# EAGLE design Adafruit BNO055 STEMMA QT (EAGLE 9.6.1)
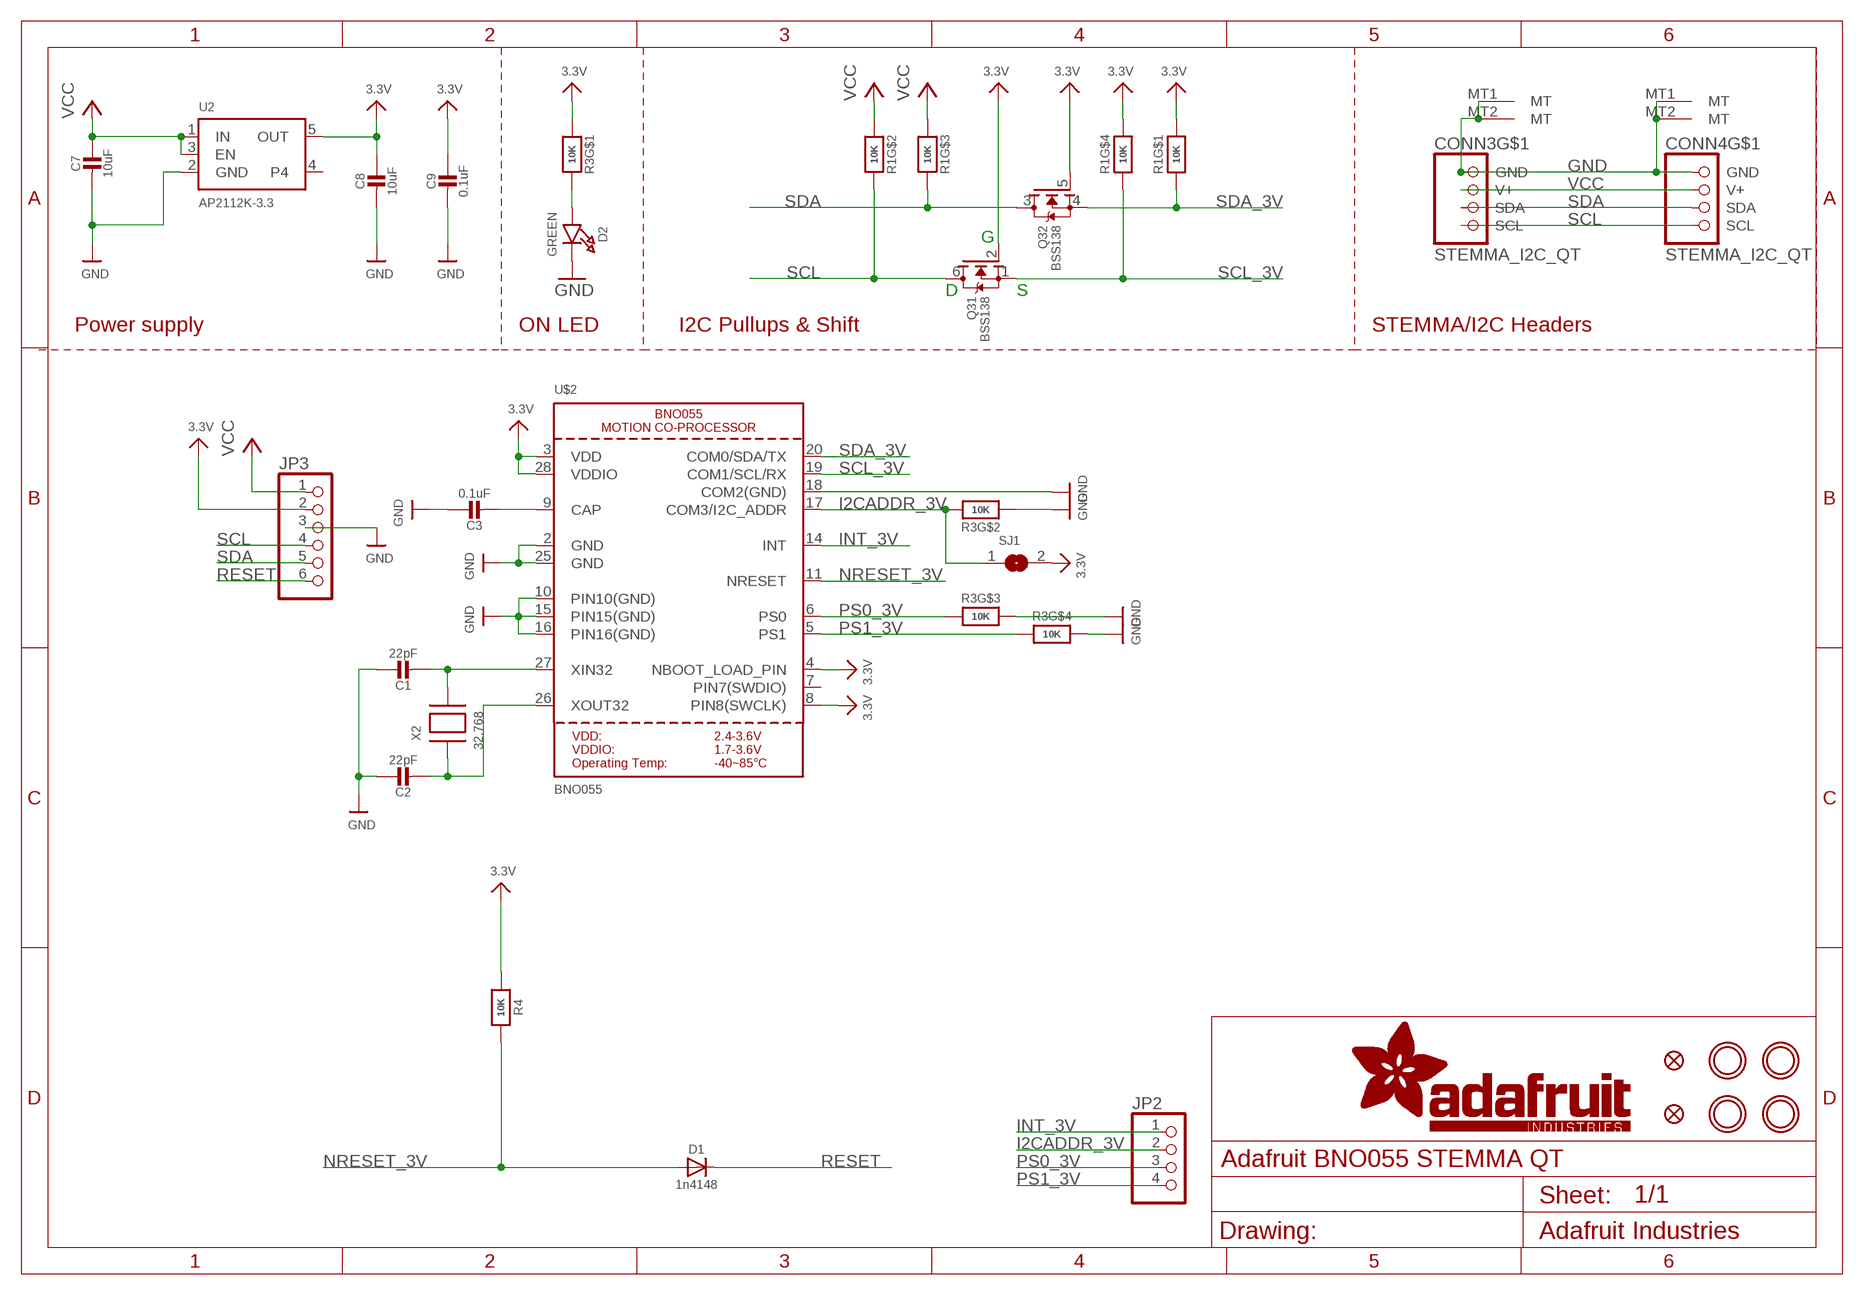
[diagram p0: schematic, sheet 1]

## Parts
C1  22pF  CAP_CERAMIC0603_NO  [0603-NO]
C2  22pF  CAP_CERAMIC0603_NO  [0603-NO]
C3  0.1uF  CAP_CERAMIC0603_NO  [0603-NO]
C7  10uF  CAP_CERAMIC0805-NOOUTLINE  [0805-NO]
C8  10uF  CAP_CERAMIC0805-NOOUTLINE  [0805-NO]
C9  0.1uF  CAP_CERAMIC0603_NO  [0603-NO]
CONN3  STEMMA_I2C_QT  [JST_SH4]
CONN4  STEMMA_I2C_QT  [JST_SH4]
D1  1n4148  DIODESOD-323  [SOD-323]
D2  GREEN  LED0603_NOOUTLINE  [CHIPLED_0603_NOOUTLINE]
FID3  FIDUCIAL_1MM  [FIDUCIAL_1MM]
FID4  FIDUCIAL_1MM  [FIDUCIAL_1MM]
JP2  HEADER-1X476MIL  [1X04_ROUND_76]
JP3  HEADER-1X670MIL  [1X06_ROUND_70]
Q3  BSS138  MOSFET-N_DUAL  [SOT363]
R1  10K  RESISTOR_4PACK  [RESPACK_4X0603]
R3  10K  RESISTOR_4PACK  [RESPACK_4X0603]
R4  10K  RESISTOR_0603_NOOUT  [0603-NO]
SJ1  SOLDERJUMPER  [SOLDERJUMPER_ARROW_NOPASTE]
U2  AP2112K-3.3  VREG_SOT23-5  [SOT23-5]
U$2  BNO055  [BNO055]
U$45  MOUNTINGHOLE2.5  [MOUNTINGHOLE_2.5_PLATED]
U$46  MOUNTINGHOLE2.5  [MOUNTINGHOLE_2.5_PLATED]
U$48  MOUNTINGHOLE2.5  [MOUNTINGHOLE_2.5_PLATED]
U$49  MOUNTINGHOLE2.5  [MOUNTINGHOLE_2.5_PLATED]
X2  32.768  XTAL-3.2X1.5  [XTAL3215]

## Nets
3.3V: C8.1 C9.1 JP3.2 Q3.2(1:G) Q3.5(2:G) R1.1 R1.4 R3.1 R4.1 SJ1.2 U2.5(OUT) U$2.3(VDD) U$2.4(NBOOT_LOAD_PIN) U$2.8(PIN8(SWCLK)) U$2.28(VDDIO)
GND: C1.1 C2.1 C3.1 C7.2 C8.2 C9.2 CONN3.1(GND) CONN3.MT1(MT) CONN3.MT2(MT) CONN4.1(GND) CONN4.MT1(MT) CONN4.MT2(MT) D2.C JP3.3 R3.2 R3.5 R3.6 U2.2(GND) U$2.2(GND) U$2.10(PIN10(GND)) U$2.15(PIN15(GND)) U$2.16(PIN16(GND)) U$2.18(COM2(GND)) U$2.25(GND)
I2CADDR_3V: JP2.2 R3.7 SJ1.1 U$2.17(COM3/I2C_ADDR)
INT_3V: JP2.1 U$2.14(INT)
N$1: C1.2 U$2.27(XIN32) X2.P$2
N$2: C2.2 U$2.26(XOUT32) X2.P$1
N$3: C3.2 U$2.9(CAP)
N$4: D2.A R3.8
NRESET_3V: D1.A R4.2 U$2.11(NRESET)
PS0_3V: JP2.3 R3.3 U$2.6(PS0)
PS1_3V: JP2.4 R3.4 U$2.5(PS1)
RESET: D1.C JP3.6
SCL: CONN3.4(SCL) CONN4.4(SCL) JP3.4 Q3.6(1:D) R1.7
SCL_3V: Q3.1(1:S) R1.5 U$2.19(COM1/SCL/RX)
SDA: CONN3.3(SDA) CONN4.3(SDA) JP3.5 Q3.3(2:D) R1.6
SDA_3V: Q3.4(2:S) R1.8 U$2.20(COM0/SDA/TX)
VCC [highpower]: C7.1 CONN3.2(V+) CONN4.2(V+) JP3.1 R1.2 R1.3 U2.1(IN) U2.3(EN)
Unconnected: U2.4 U$2.7(PIN7(SWDIO))

## Notes on the sheet
- G
- D | S
- Power supply | ON LED | I2C Pullups & Shift | STEMMA/I2C Headers

## Library data of the parts
C1-C3 C7-C9 = microbuilder:CAP_CERAMIC: Ceramic Capacitors For new designs, use the packages preceded by an '_' character since they are more reliable: The following footprints should be used on most boards: _0402 - Standard footprint for regular board layouts _0603 - Standard footprint for regular board layouts _0805 - Standard footprint for regular board layouts _1206 - Standard footprint for regular board layouts For extremely tight-pitch boards where space is at a premium, the following 'micro-pitch' footprints can be used (smaller pads, no silkscreen outline, etc.): _0402MP - Micro-pitch footprint for very dense/compact boards _0603MP - Micro-pitch footprint for very dense/compact boards _0805MP - Micro-pitch footprint for very dense/compact boards _1206MP - Micro-pitch footprint for very dense/compact boards
CONN3 CONN4 = microbuilder:STEMMA_I2C
D1 = microbuilder:DIODE: Diode SMA Model Volts Amps Type Vf Ir Digikey # Notes SSA34-E3 40V 3A Schottky 480mV @ 3A 200uA @ 40V SSA34-E3/61TGITR-ND CDBA120-G 20V 1A Schottky 500mV @ 1A 500uA @ 20V 641-1014-6-ND REEL MBRA210 10V 2A Schottky 350mV @ 2A 700uA @ 10V MBRA210LT3 SOD-123 Model Volts Amps Type Vf Ir Order # Notes BAT54T1G 30V 200mA Schottky 800mV @ 200mA 2uA @ 25V BAT54T1GOSTR-ND B0530W 30V 500mA Schottky 430mV @ 500mA 130uA @ 30V B0530W-FDICT-ND REEL MBR120 20V 1A Schottky 340mV @ 1A MBR120VLSFT1GOSCT-ND SOD-323 Model Volts Amps Type Vf Ir Order # Notes PMEG2005EJ 20V 500mA Schottky 355mV @ 500mA 568-4110-1-ND ZLLS410 10V 570mA Schottky 380mV @ 570mA ZLLS410CT-ND 1N4148WS 75V 150mA Silicon/Simple 1V 1N4148WSFSCT-ND REEL SOD-523 Model Volts Amps Type Vf Ir Order # Notes BAT54XV2 30V 200mA Schottky 0.8V @ 100mA BAT54XV2CT-ND TB751S 30V 30mA Schottky RB751S-40TE61CT-ND SOT23-R/W (R = Solder Paste/Reflow Ovens, W = Hand-Soldering) Model Volts Amps Type Vf Ir Order # Notes BAT54FILM 40V 300mA Schottky 497-7162-1-ND POWERDI-5 Model Volts Amps Type Vf Ir Order # Notes PDS560 60V 5A Schottky 670mV @ 5A 150uA @ 60V PDS560DICT-ND
D2 = microbuilder:LED: LED 0603 - 0603 Surface Mount Package 2mA: Green LED - Low Power (3.9mcd, 2ma, 1.7Vf) - Digikey: 475-2709-2-ND Orange LED - Low Power (9.8mcd, 2ma, 1.8Vf) - Digikey: 475-1194-2-ND Red LED - Low Power (5mcd, 2ma, 1.8Vf) - Digikey: 475-1195-2-ND Yellow LED - Low Power (7mcd, 2ma, 1.8Vf) - Digikey: 475-1196-2-ND 5mA: Blue LED - Low Power (17mcd, 5ma, 2.9Vf) - Digikey: LNJ937W8CRACT-ND 0805 - 0805 Surface Mount Package 2mA: Red LED (8.8mcd, 2mA, 1.8Vf, Clear) - Low Power [Digikey: 475-2510-1-ND] Green LED (5mcd, 2mA, 1.8Vf, Clear) - Low Power [Digikey: 475-2730-1-ND] Yellow LED (11.3mcd, 2mA, 1.8Vf, Clear) - Low Power [Digikey: 475-2555-1-ND] 20mA: Red LED (104mcd, 20mA, Diffused) - LS R976 [Digikey: 475-1278-6-ND] Red LED (12mcd, 20mA, 2.0Vf, Clear) - APT2012EC [Digikey: 754-1128-1-ND] Green LED (15mcd, 20mA, 2.2Vf, Clear) - APT2012GC [Digikey: 754-1131-1-ND] Orange LED (160mcd, 20mA, 2.1Vf, Clear) - APT2012SECK [Digikey: 754-1130-1-ND] 1206 - 1206 Surface Mount Package Green LED (26mcd, 20mA, Diffused) - LG N971 [Digikey: 475-1407-6-ND] Red LED (15mcd, 20mA, Diffused) - LH N974 [Digikey: 475-1416-6-ND] Cree - Cree High-Power Surface Mount LEDs XPEBWT-L1-0000-00D50 - White 111lm 350mA 2.9Vf 6200K 110° XTEAWT-00-0000-00000LEE3 - White 114lm 350mA 2.85Vf 5000K 115° Everlight - Everlight 45-21 Series Surface Mount LEDs 45-21/QK2C-B2832AC2CB2/2T - Warm White 2000mcd 20mA 3.25Vf 3050K 120° 45-21/LK2C-B38452C4CB2/2T - Nuetral White 2000mcd 20mA 3.25Vf 4150K 120° 45-21/LK2C-B50634C6CB2/2T - Cold White 2200mcd 20mA 3.25Vf 5650K 120° PLCC2 Reverse Mount LS T77K-J1L2-1-0-2-R18-Z - Red 11.25mcd 2mA 1.8Vf 630nm 120° LO T77K-L1M2-24-Z - Orange 19.6mcd 2mA 1.8Vf 606nm 120° LY T77K-K2M1-26-Z - Yellow 15.7mcd 2mA 1.8Vf 587nm 120°
FID3 FID4 = microbuilder:FIDUCIAL: Fiducial Alignment Points Various fiducial points for machine vision alignment.; BOM: EXCLUDE
JP2 = microbuilder:HEADER-1X4: PIN HEADER
JP3 = microbuilder:HEADER-1X6: PIN HEADER
Q3 = microbuilder:MOSFET-N_DUAL: Dual N-Channel MOSFET SOT363 (2.0x1.25mm) 2N7002PS - 60V, 320mA [Digikey: 568-5984-1-ND]
R1 R3 = microbuilder:RESISTOR_4PACK: Resistor Packs (4 resistors) 4 x 0603 10K 1/16W - Digikey: YC164J-10KCT-ND
R4 = microbuilder:RESISTOR: Resistors For new designs, use the packages preceded by an '_' character since they are more reliable: The following footprints should be used on most boards: _0402 - Standard footprint for regular board layouts _0603 - Standard footprint for regular board layouts _0805 - Standard footprint for regular board layouts _1206 - Standard footprint for regular board layouts For extremely tight-pitch boards where space is at a premium, the following 'micro-pitch' footprints can be used (smaller pads, no silkscreen outline, etc.): _0402MP - Micro-pitch footprint for very dense/compact boards _0603MP - Micro-pitch footprint for very dense/compact boards _0805MP - Micro-pitch footprint for very dense/compact boards _1206MP - Micro-pitch footprint for very dense/compact boards
SJ1 = microbuilder:SOLDERJUMPER: SMD Solder JUMPER Solder the two pads together to create a connection, or remove the solder to break it. REFLOW - Use this footprint for solder paste and reflow ovens. WAVE - Use this footprint for hand-soldering (larger pads). CLOSED - Has a trace between the two pads to ensure it is closed by default. The trace needs to be cut to disable the jumper, and can be closed again by creating a solder bridge between the two pads.; BOM: EXCLUDE
U2 = microbuilder:VREG_SOT23-5: SOT23-5 Fixed Voltage Regulators Part Current Out V Out V In V Dropout θJA (°C/W) TJ (°C) Digikey Part No. ADP121 150mA 3.3V 3.4-5.5V 0.09V @ 150mA -- -- ADP121-AUJZ33R7CT-ND ADP121 150mA 3.0V 3.1-5.5V 0.09V @ 150mA -- -- ADP121-AUJZ30R7CT-ND ADP122 300mA 3.3V 3.4-5.5V 0.085V @ 300mA -- -- ADP122AUJZ-3.3-R7CT-ND ADP1712 300mA 3.3V 3.5-5.5V 0.17V @ 300mA -- -- ADP1712AUJZ-3.3-R7TR-ND AP7311 (Low Cost) 150mA 3.3V 3.5-6V 0.15V @ 150mA -- -- AP7311-33WG-7DICT-ND LD39015M18R 150mA 1.8V 1.9V-5.5V 0.08V @ 100mA -- -- 497-6977-1-ND LP2985A-33DBVR 150mA 3.3V 3.3-16V 0.28V @ 150mA 206 150 296-18479-1-ND MCP1824T-3302E/OT 300mA 3.3V 3.5V-6V 0.2V @ 300mA -- -- MCP1824T-3302E/OTCT-ND MIC5205-2.5YM5 TR 150mA 2.5V 2.7-16V 0.165V @ 150mA -- -- 576-1257-2-ND MIC5205-3.0YM5 TR 150mA 3.0V 3.2V-16V 0.165V @ 150mA -- -- 576-1258-2-ND MIC5205-3.3YM5 TR 150mA 3.3V 3.5V-16V 0.165V @ 150mA -- -- 576-1259-2-ND TPS780330220 150mA 3.3V+2.2V 3.6-5.5V 250mV Max -- -- 296-23332-1-ND TDA3663/N1,135 100mA 3.3V 3.5-45V 0.18V @ 50mA -- -- 568-5343-1-ND Max operating temp can be calculated using θJA, TJ (max junction temperature), and power in watts. Set the "Maximum Ambient Temperature" until it reaches TJ ("Max Junction Temperature"), which is the absolute limit for safe use of the regulator: Heat Sink Temperature Calculator <http://www.daycounter.com/Calculators/Heat-Sink-Temperature-Calculator.phtml> For example, With 12V source into a 3.3V LP2985 and a 30mA load, we are dissipating (12V-3.3V) * 0.03A = 0.261W. With a θJA of 206 °C/W, a TJ of 150°C, and 261mW we can safely use the chip without a heat sink up to 75°C (=147.1°C Junction Temperature).
U$2 = microbuilder:BNO055: BNO055 - Motion Co-Processor
U$45 U$46 U$48 U$49 = microbuilder:MOUNTINGHOLE: Mounting Hole For #2 screws (0.086"/2.18mm width, 0.094"/2.4mm hole) use 2.5mm; BOM: EXCLUDE
X2 = adafruit2:XTAL: Low cost SMT crystals, no capacitors included http://www.ladyada.net/library/eagle

## Net classes
1 highpower: width 0.406 mm, drill 0.483 mm
2 lowpower: width 0.305 mm, drill 0.483 mm

## Board
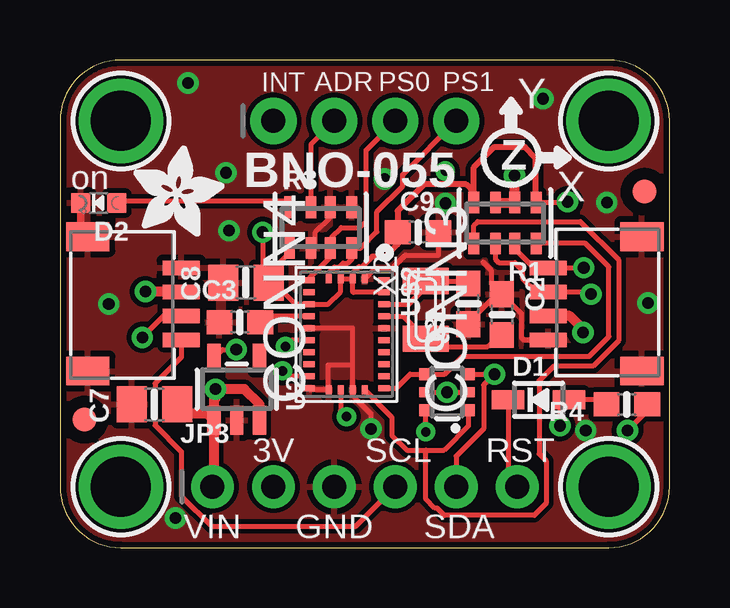
[diagram p1: board, top side]
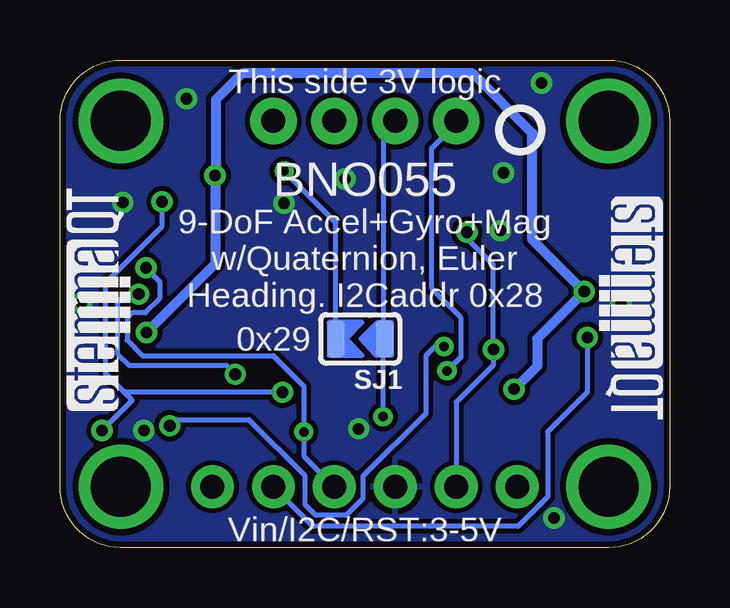
[diagram p2: board, bottom side, seen from below]

Size 25.4 x 20.32 mm. Coordinates in mm from the lower left corner, seen from the top.
Outline: 0,17.78 0,2.54 arc90 2.54,0 22.86,0 arc90 25.4,2.54 25.4,17.78 arc90 22.86,20.32 2.54,20.32 arc90 0,17.78
Copper layers (1*16): Top 0.035mm / dielectric 1.5mm / Bottom 0.035mm
Design rules "adafruit *": minimum track width 8mil, minimum drill 15.5mil, track to track 8mil, track to pad 8mil, pad to pad 8mil, via to via 8mil, smd to smd 8mil, copper to edge 10mil, drill to drill 8mil, minimum pad ring 10mil, minimum via ring 8mil, stop-mask expansion 2mil, vias tented up to drill 20mil, thermal gap 10mil

### Footprints (pad centres in the part's own frame; a part is rotated, then mirrored left to right if it is on the bottom)
0603-NO = smd 1.075 x 1: 1 -0.85,0; 2 0.85,0
0805-NO = smd 1.24 x 1.5: 1 -0.95,0; 2 0.95,0
JST_SH4 = smd 0.6 x 1.55: 1 -1.5,2.514; 2 -0.5,2.514; 3 0.5,2.514; 4 1.5,2.514 | smd 1.2 x 1.8: MT1 -2.8,-1.386; MT2 2.8,-1.386
SOD-323 = smd 1.35 x 0.8: A 1.27,0; C -1.27,0
CHIPLED_0603_NOOUTLINE = smd 0.8 x 0.8: A 0,-0.75; C 0,0.75
FIDUCIAL_1MM = smd 1 x 1: 1 0,0
1X04_ROUND_76 = drill 1 pad 1.93: 1 -3.81,0; 2 -1.27,0; 3 1.27,0; 4 3.81,0
1X06_ROUND_70 = drill 1 pad 1.778: 1 -6.35,0; 2 -3.81,0; 3 -1.27,0; 4 1.27,0; 5 3.81,0; 6 6.35,0
SOT363 = smd 0.5 x 0.5: 1 -0.75,-0.9; 3 0.75,-0.9; 4 0.75,0.9; 6 -0.75,0.9 | smd 0.4 x 0.5: 2 0,-0.9; 5 0,0.9
RESPACK_4X0603 = smd 0.45 x 0.9: 1 -1.3,-0.85; 2 -0.4,-0.85; 3 0.4,-0.85; 4 1.3,-0.85; 5 1.3,0.85; 6 0.4,0.85; 7 -0.4,0.85; 8 -1.3,0.85
SOLDERJUMPER_ARROW_NOPASTE = smd 0.762 x 1.524: 1 -1.016,0; 2 1.016,0
SOT23-5 = smd 0.55 x 1.2: 1 -0.95,-1.3; 2 0,-1.3; 3 0.95,-1.3; 4 0.95,1.3; 5 -0.95,1.3
BNO055 = smd 0.25 x 0.475: 1 -2.25,1.562; 6 -2.25,-1.562; 7 -1.75,-1.562; 8 -1.25,-1.562; 9 -0.75,-1.562; 10 -0.25,-1.562; 11 0.25,-1.562; 12 0.75,-1.562; 13 1.25,-1.562; 14 1.75,-1.562; 15 2.25,-1.562; 20 2.25,1.562; 21 1.75,1.562; 22 1.25,1.562; 23 0.75,1.562; 24 0.25,1.562; 25 -0.25,1.562; 26 -0.75,1.562; 27 -1.25,1.562; 28 -1.75,1.562 | smd 0.375 x 0.25: 2 -2.312,0.75; 3 -2.312,0.25; 4 -2.312,-0.25; 5 -2.312,-0.75; 16 2.312,-0.75; 17 2.312,-0.25; 18 2.312,0.25; 19 2.312,0.75
MOUNTINGHOLE_2.5_PLATED = drill 2.5 pad 3.2: P$1 0,0
XTAL3215 = smd 1.1 x 1.9: P$1 1.2,0; P$2 -1.2,0

### Placement (x,y rotation side)
C1  17.02,10.16 90 top
C2  18.41,9.72 270 top
C3  7.49,9.4 0 top
C7  3.94,5.97 180 top
C8  7.75,11.05 180 top
C9  14.92,13.14 0 top
CONN3  22.86,10.16 90 top
CONN4  2.54,10.16 270 top
D1  19.94,6.16 0 top
D2  1.61,14.36 90 top
FID3  1.02,5.33 0 top
FID4  24.36,14.83 0 top
JP2  12.7,17.78 0 top
JP3  12.7,2.54 0 top
Q3  16.13,6.48 90 top
R1  18.54,13.53 180 top
R3  10.86,13.34 0 top
R4  23.62,5.97 180 top
SJ1  12.89,8.7 180 bottom
U2  7.37,6.6 0 top
U$2  11.94,8.89 270 top
U$45  2.54,17.78 0 top
U$46  22.86,17.78 0 top
U$48  2.54,2.54 0 top
U$49  22.86,2.54 0 top
U$51  [ADAFRUIT_3.5MM]  3.05,12.95 0 top
U$52  [PCBFEAT-REV-040]  6.22,17.4 0 bottom
U$53  [STEMMAQT]  22.48,5.71 90 bottom
U$54  [STEMMAQT]  2.92,14.61 270 bottom
X2  15.24,9.91 270 top

### Tracks (layer width: path | path; a pad name or v marks a point on that pad's centre or on a via)
3.3V  (via drill 0.39, 0.48)
  Top 0.203: Q3.5 v16.13,6.48 Q3.2 | U$2.28 12.22,10.64 12.19,10.67 12.19,11.18 | 12.19,11.18 U$2.3 12.19,11.45 12.45,11.71 12.6,11.71 13.02,12.13 | 12.19,11.18 12.16,11.2 U$2.4 11.69,10.67 11.16,10.14 U$2.8 9.8,10.14 8.89,11.05 C8.1 8.7,11.43 8.73,11.46 | U2.5 6.77,8.26 v7.34,8.26 | v8.45,13.14 8.45,11.75 8.73,11.46 | R3.1 9.56,12.29 8.73,11.46 | R4.1 24.47,5.71 v23.65,4.89 | v21.14,14.41 21.11,14.38 R1.1 | v16.06,15.69 v16.07,15.68 16.07,15.14
  Top 0.254: R1.1 19.81,14.4 19.81,16.26 19.37,16.7 18.1,16.7 17.24,15.85 R1.4 17.24,14.82 16.92,15.14 16.07,15.14 15.18,15.14 14.07,14.03 C9.1 14.07,12.64 13.56,12.13 13.02,12.13
  Bottom 0.203: JP3.2 8.89,6.06 7.34,7.61 v7.34,8.26 7.34,11.79 8.7,13.14 v8.45,13.14 | v23.65,4.89 22.4,6.14 22.73,6.48 | v16.13,6.48 22.73,6.48 | 22.73,6.48 23.5,7.24 23.5,11.05 21.14,13.4 v21.14,14.41 | SJ1.2 13.91,13.54 v16.06,15.69
GND  (via drill 0.48)
  Top 0.203: 12.19,7.62 U$2.18 12.19,6.33 12.44,6.08 12.46,6.08 12.95,5.59 v12.95,4.95 | 12.19,7.62 12.19,9.14 U$2.10 | U$2.15 10.44,6.58 U$2.16 11.18,6.59 11.18,7.62 12.19,7.62 | 12.69,11.3 U$2.2 13.11,11.62 13.82,11.62 14.39,12.19 15.77,12.19 C9.2 | C2.1 17.97,11.01 17.97,11.56 17.63,11.9 | C1.1 17.02,9.38 18.2,10.57 C2.1 | C2.1 19.22,9.76 19.22,8.76 19.32,8.66 CONN3.1 | R3.6 11.26,13.75 10.62,13.11 10.62,12.65 R3.2
  Top 0.305: D2.C 0.86,13.25 CONN4.MT1
  other vias: 16.07,14.35 2.03,10.16 7.05,13.21 6.92,15.62 21.91,4.89 5.33,19.37 13.53,15.37 24.5,10.2 22.78,14.39 20.13,18.71 4.81,1.23
  pour Top: 0,20.32 0,0 25.4,0 25.4,20.32
  pour Bottom: 0,20.32 0,0 25.4,0 25.4,20.32
I2CADDR_3V  (via drill 0.39)
  Top 0.203: U$2.17 11.69,5.71 v11.94,5.46 | JP2.2 10.46,16.81 R3.7
  Bottom 0.203: v11.94,5.46 11.94,8.7 11.91,8.7 | 11.91,8.7 11.91,16.62 11.91,16.94 11.91,17.3 JP2.2 | SJ1.1 11.91,8.7
INT_3V  (via drill 0.39)
  Top 0.203: U$2.14 9.5,7.14 v9.27,7.37
  Bottom 0.203: v9.27,7.37 8.69,7.95 8.69,9.58 9.91,10.79 9.91,16.65 8.89,17.67 JP2.1
N$1
  Top 0.203: X2.P$2 15.49,11.11 | 15.49,11.11 16.92,11.11 C1.2 | U$2.27 14.53,10.14 15.49,11.11
N$2
  Top 0.203: C2.2 18.3,8.87 17.81,8.38 15.56,8.38 X2.P$1 14.31,9.64 U$2.26
N$3
  Top 0.203: U$2.9 8.59,9.64 C3.2
N$4
  Top 0.203: D2.A 2.44,14.44 9.3,14.44 R3.8
NRESET_3V  (via drill 0.39, 0.48)
  Top 0.203: R4.2 22.58,6.16 D1.A 20.83,5.78 v20.83,5.08 | U$2.11 9.66,8.64 v9.4,8.38
  Bottom 0.203: v9.4,8.38 9.78,8.38 10.16,8 10.16,5.59 12.78,2.97 12.78,2.05 13.48,1.35 14.74,1.35 15.19,1.79 15.19,3 17.53,5.33 20.57,5.33 v20.83,5.08
PS0_3V
  Top 0.203: U$2.6 10.38,11.22 11.26,12.1 R3.3 11.31,12.54 11.31,12.93 11.71,13.34 12.48,13.34 12.75,13.61 12.75,16.56 JP2.3
PS1_3V
  Top 0.203: U$2.5 11.19,11.45 11.44,11.7 11.63,11.7 11.79,11.86 11.99,11.86 12.16,12.03 R3.4 12.54,12.48 13.21,13.15 13.21,13.99 14.28,15.06 14.28,15.54 JP2.4
RESET
  Top 0.203: D1.C 18.67,2.92 JP3.6
SCL  (via drill 0.39, 0.48)
  Top 0.203: v15.24,4.83 15.23,4.84 Q3.6 | R1.7 19.05,12.57 19.05,12.36 19.75,11.66 CONN3.4 v21.82,11.66 | CONN4.4 5.05,7.94 3.96,6.84 3.96,5.09 5.05,4 5.05,2.15 6.31,0.89 12.32,0.89 JP3.4
  Bottom 0.203: JP3.4 15.24,3.81 v15.24,4.83 15.24,6.73 16.51,8 21.97,8 22.61,8.64 22.61,9.59 22.42,9.78 21.84,9.78 21.25,10.37 21.25,11.09 v21.82,11.66
SCL_3V
  Top 0.203: U$2.19 13.83,5.43 13.83,4.67 14.44,4.06 15.24,4.06 | Q3.1 17.03,5.09 16,4.06 15.24,4.06 | R1.5 17.24,13.43 17.4,13.59 21.68,13.59 23.28,11.99 23.28,8.63 22.21,7.57 20.57,7.57 19.96,6.96 19.96,3.91 20.26,3.62 20.26,1.84 19.76,1.35 16.02,1.35 15.71,1.65 15.62,1.65 15.24,2.03 15.24,4.06
SDA  (via drill 0.48)
  Top 0.203: Q3.3 17.66,7.23 17.67,7.23 v18.1,7.23 17.65,6.78 17.65,4.95 16.51,3.81 JP3.5 | CONN4.3 4.33,9.66 v3.43,8.76 | v22.12,10.56 22.02,10.66 CONN3.3 19.84,10.66 19.27,11.23 19.27,11.56 18.96,11.87 18.29,11.87 18.14,12.02 R1.6
  Bottom 0.203: v3.43,8.76 3.43,6.48 5.08,4.83 5.08,2.12 6.31,0.89 14.86,0.89 JP3.5 | v22.12,10.56 22.65,10.56 23.01,10.2 23.01,8.09 22.52,7.59 18.47,7.59 v18.1,7.23
SDA_3V
  Top 0.203: U$2.20 14.01,6.64 14.59,7.23 Q3.4 16.03,7.23 16.78,7.98 22.05,7.98 22.87,8.8 22.87,11.7 21.89,12.68 R1.8
VCC  (via drill 0.48)
  Top 0.406: R1.3 R1.2 v18.94,15.5 v18.94,15.51 | v21.79,8.97 21.79,9.1 21.23,9.66 CONN3.2 | CONN4.2 v3.56,10.66 v3.56,10.67 | U2.1 6.42,6.16 6.48,6.22 v6.48,6.6 7.68,6.6 8.32,5.97 U2.3 | C7.1 4.89,5.84 5.14,5.59 6.13,5.59 U2.1 | U2.1 6.42,2.61 JP3.1
  Bottom 0.406: v21.79,8.97 18.94,11.83 v18.94,15.51 18.91,15.53 18.91,18.66 17.8,19.76 8.2,19.76 5.71,17.27 5.71,12.83 v3.56,10.67 5.52,8.7 5.52,7.56 v6.48,6.6

### Text on the board
tPlace: Y | INT | ADR | PS0 | PS1 | BNO-055 | Z | on | X | 3V | SCL | RST | VIN | GND | SDA
bPlace: This side 3V logic | BNO055 | 9-DoF Accel+Gyro+Mag / w/Quaternion, Euler / Heading. I2Caddr 0x28 | 0x29 | Vin/I2C/RST:3-5V